# EAGLE design doorbell modernizr v3 + prog v0.2 (EAGLE 7.6.0)
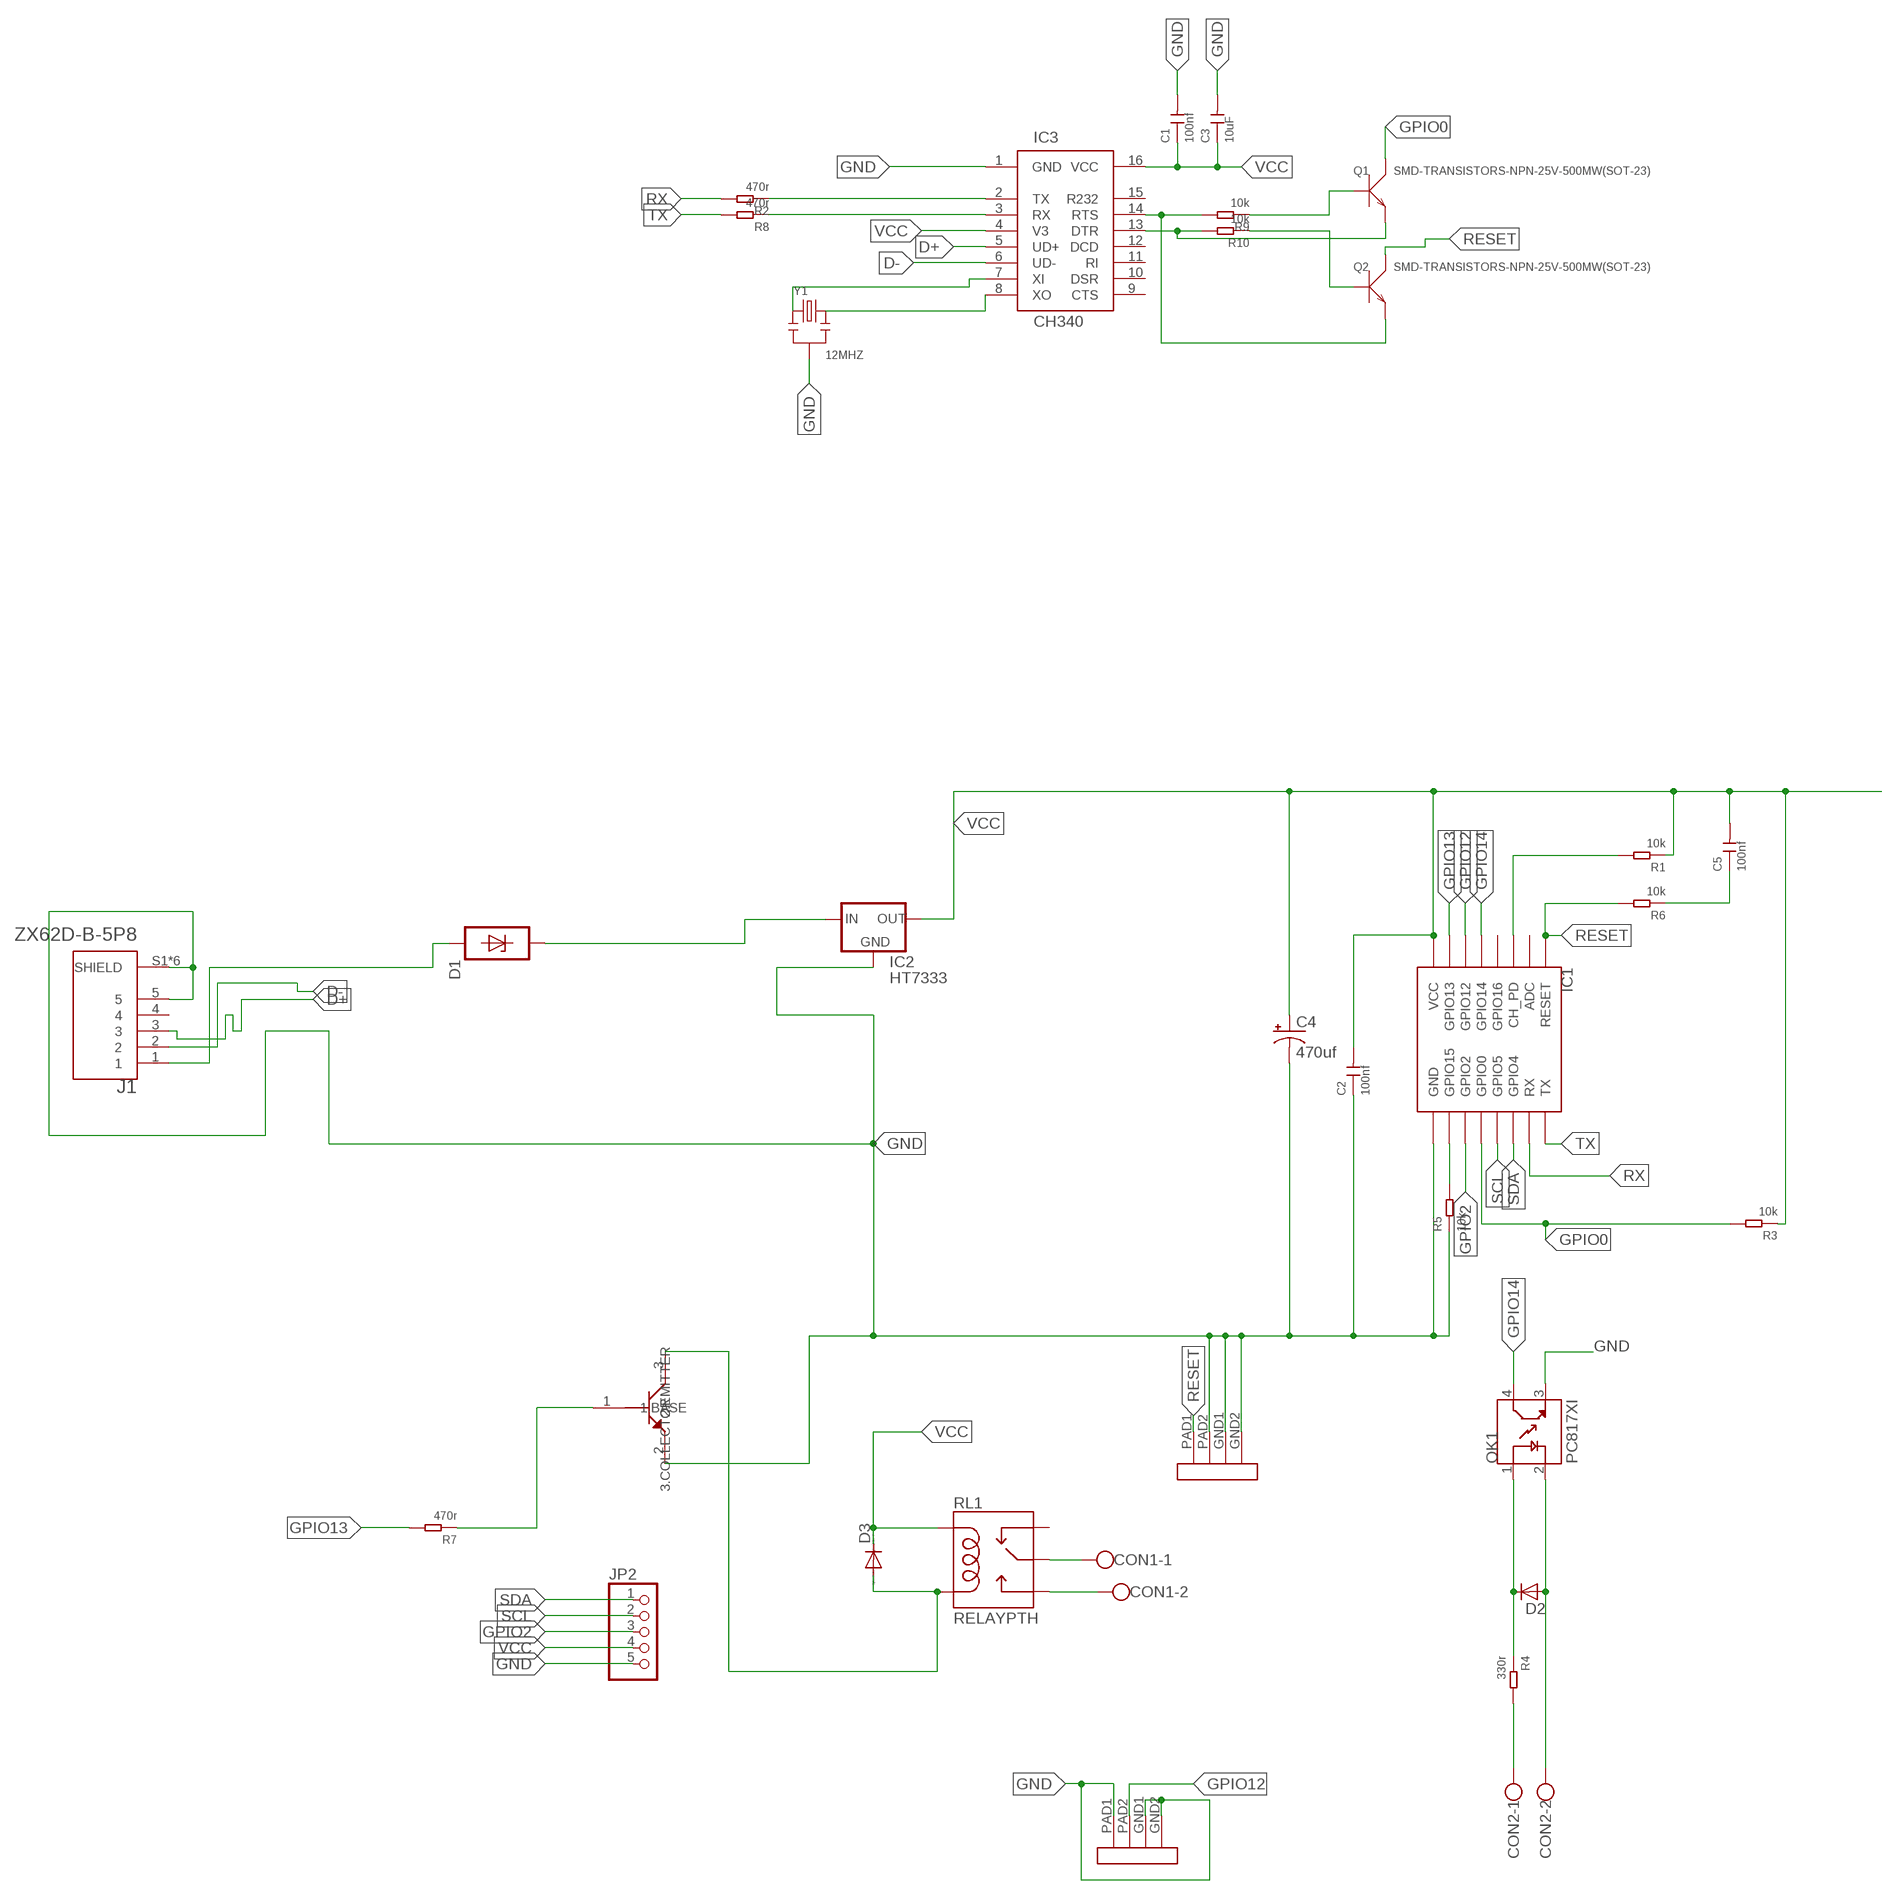
[diagram p0: schematic, sheet 1]

## Parts
C1  100nf  CERAMIC-1UF-25V-10%-X7R(0603)  [C0603]
C2  100nf  CERAMIC-1UF-25V-10%-X7R(0603)  [C0603]
C3  10uF  CERAMIC-1UF-25V-10%-X7R(0603)  [C0603]
C4  470uf  47UF-50V-20%(ELECT)  [PANASONIC_D]
C5  100nf  CERAMIC-1UF-25V-10%-X7R(0603)  [C0603]
CON1  W237-102  [W237-102]
CON2  W237-102  [W237-102]
D1  SP4020-01FTG  [SOD323]
D2  D-SOD123  [SOD123]
D3  DIODE-SOD123  [SOD123]
IC1  ESP12SMD  [ESP12-SMD]
IC2  HT7333  [SOT-89]
IC3  CH340  [SOIC16]
J1  ZX62D-B-5P8  [HRS_ZX62D-B-5P8]
JP2  PINHD-1X5  [1X05]
OK1  PC817XI  [SOIC254P975X460-4N]
Q1  SMD-TRANSISTORS-NPN-25V-500MW(SOT-23)  [SOT-23]
Q2  SMD-TRANSISTORS-NPN-25V-500MW(SOT-23)  [SOT-23]
Q3  2N2222  [SOT23]
R1  10k  SMD-RES-39R-5%-1/10W(0603)  [R0603]
R2  470r  SMD-RES-39R-5%-1/10W(0603)  [R0603]
R3  10k  SMD-RES-39R-5%-1/10W(0603)  [R0603]
R4  330r  SMD-RES-39R-5%-1/10W(0603)  [R0603]
R5  10k  SMD-RES-39R-5%-1/10W(0603)  [R0603]
R6  10k  SMD-RES-39R-5%-1/10W(0603)  [R0603]
R7  470r  SMD-RES-39R-5%-1/10W(0603)  [R0603]
R8  470r  SMD-RES-39R-5%-1/10W(0603)  [R0603]
R9  10k  SMD-RES-39R-5%-1/10W(0603)  [R0603]
R10  10k  SMD-RES-39R-5%-1/10W(0603)  [R0603]
RL1  RELAYPTH  [SRD-05VDC-SL-C]
SW1  MINI-SIDE-SWITCH  [MINI-SIDE-SWITCH]
SW2  MINI-SIDE-SWITCH  [MINI-SIDE-SWITCH]
Y1  12MHZ  SMD-RESONATOR-8MHZ-33PF-0.1%(3P-3.2X1.3MM)  [X3-SMD-3.6X1.3X0.8MM]

## Nets
D+: IC3.5(UD+) J1.3
D-: IC3.6(UD-) J1.2
GND: C1.2 C2.1 C3.2 C4.- IC1.GND IC2.2(GND) IC3.1(GND) J1.5 J1.S1(SHIELD) J1.S2(SHIELD) J1.S3(SHIELD) J1.S4(SHIELD) J1.S5(SHIELD) J1.S6(SHIELD) JP2.5 OK1.3(ET) Q3.2(2.EMITTER) R5.1 SW1.GND1 SW1.GND2 SW1.PAD2 SW2.GND1 SW2.GND2 SW2.PAD1 Y1.2
GPIO0: IC1.GPIO0 Q1.3(C) R3.2
GPIO2: IC1.GPIO2 JP2.3
GPIO12: IC1.GPIO12 SW2.PAD2
GPIO13: IC1.GPIO13 R7.2
GPIO14: IC1.GPIO14 OK1.4(CT)
N$1: IC1.GPIO15 R5.2
N$2: D3.A Q3.3(3.COLLECTOR) RL1.COIL0
N$3: D2.1(C) OK1.1(A) R4.1
N$4: CON2.2 D2.2(A) OK1.2(C)
N$5: IC1.CH_PD R1.2
N$6: CON2.1 R4.2
N$8: CON1.2 RL1.SWOPEN
N$9: IC3.2(TX) R2.1
N$10: D1.1 IC2.4(IN) IC2.P$2(IN)
N$12: CON1.1 RL1.SWCOMMON
N$13: IC3.3(RX) R8.1
N$14: Q3.1(1.BASE) R7.1
N$15: IC3.14(RTS) Q2.2(E) R9.2
N$16: IC3.13(DTR) Q1.2(E) R10.2
N$17: Q1.1(B) R9.1
N$18: Q2.1(B) R10.1
N$19: IC3.8(XO) Y1.3
N$20: IC3.7(XI) Y1.1
N$21: D1.2 J1.1
N$22: C5.1 R6.1
RESET: IC1.RESET Q2.3(C) R6.2 SW1.PAD1
RX: IC1.RXD0(RX) R2.2
SCL: IC1.GPIO5 JP2.2
SDA: IC1.GPIO4 JP2.1
TX: IC1.TXD0(TX) R8.2
VCC: C1.1 C2.2 C3.1 C4.+ C5.2 D3.C IC1.VCC IC2.1(OUT) IC3.4(V3) IC3.16(VCC) JP2.4 R1.1 R3.1 RL1.COIL1
Unconnected: IC1.ADC IC1.GPIO16 IC3.9(CTS) IC3.10(DSR) IC3.11(RI) IC3.12(DCD) IC3.15(R232) J1.4 RL1.SWCLOSED(SWCLOSE)

## Library data of the parts
C1-C3 C5 = Seeed-Capacitor:CERAMIC-1UF-25V-10%-X7R(0603): 302010139; MPN: CC0603KRX7R8BB105; VALUE: 1uf
C4 = SparkFun-Capacitors:47UF-50V-20%(ELECT): CAP-10547; PROD_ID: CAP-10547
CON1 CON2 = con-wago-500:W237-102: WAGO SCREW CLAMP; MPN: 237-102; OC_FARNELL: unknown; OC_NEWARK: 70K9898
D1 = sp4020_10:SP4020-01FTG: SP4020 Series 2.5pF, 30A Discrete TVS Diode Source: http://www.littelfuse.com/~/media/electronics/datasheets/tvs_diode_arrays/littelfuse_tvs_diode_array_sp4020_datasheet.pdf.pdf; MF: Littelfuse; MPN: SP4020-01FTG; OC_FARNELL: unknown; OC_NEWARK: 05X0400
D2 = semicon-smd-ipc:D-: DIODE unfilled
D3 = diode:DIODE-: DIODE
IC1 = esp8266modules:ESP12: ESP8266 Wifi module 12
IC2 = Lemcke solutions:HT73*
IC3 = CH340:CH340; AVAILABILITY: Unavailable; DESCRIPTION: CH340G USB 2.0 to UART _RS232/RS422/RS485_ Bridge Interface Evaluation Board; MF: DFRobot; MP: CH340; PACKAGE: None; PRICE: None
J1 = ZX62D-B-5P8:ZX62D-B-5P8: SMD+DIP Micro USB; MICRO-B-SMD; AVAILABILITY: Unavailable; DESCRIPTION: USB - micro B USB 2.0 Receptacle Connector 5 Position Surface Mount, Right Angle; Through Hole; MF: Hirose; MP: ZX62D-B-5P8; PACKAGE: None; PRICE: None
JP2 = pinhead:PINHD-1X5: PIN HEADER
OK1 = PC817XI:PC817XI: Semiconductors and Actives, Optocouplers/Optoisolators, trans, Optoelectronics, smd; AVAILABILITY: Unavailable; DESCRIPTION: Optoisolator Transistor Output 5000Vrms 1 Channel 4-SMD; MF: Sharp Microelectronics; MP: PC817XI; PACKAGE: SMD-4 Sharp; PRICE: None
Q1 Q2 = SMD-TRANSISTORS-NPN-25V-500MW_SOT-23_:SMD-TRANSISTORS-NPN-25V-500MW(SOT-23): 305010017; AVAILABILITY: Unavailable; DESCRIPTION: Isolated Module DC DC Converter 1 Output 5V 200mA 4.5V - 5.5V Input; MF: Recom Power; MP: S8050; PACKAGE: SOT-23 Micro Commercial; PRICE: None
Q3 = Lemcke solutions:2N2222: 1.2V Voltage Reference 50ppm/°C, SOT23, 3-Terminal Source: Data sheet <http://datasheets.maxim-ic.com/en/ds/MAX6520.pdf>; MF: MAXIM; MPN: MAX6520EUR-T; OC_FARNELL: unknown; OC_NEWARK: 02J4586
R1-R10 = Seeed-Resistor:SMD-RES-39R-5%-1/10W(0603): 301010138; MPN: RC0603JR-0739RL; VALUE: 39R 1/10W
RL1 = SRD-05VDC-SL-C:RELAY: SPDT relay (COM-00101)
SW1 SW2 = Lemcke solutions:MINI-SIDE-SWITCH
Y1 = Seeed-Crystal Oscillator:SMD-RESONATOR-8MHZ-33PF-0.1%(3P-3.2X1.3MM): 306030005; MPN: CSTCE8M00G15L99-R0; VALUE: 8MHZ

## Net classes
0 default: width 0.203 mm, clearance 0.205 mm

## Board
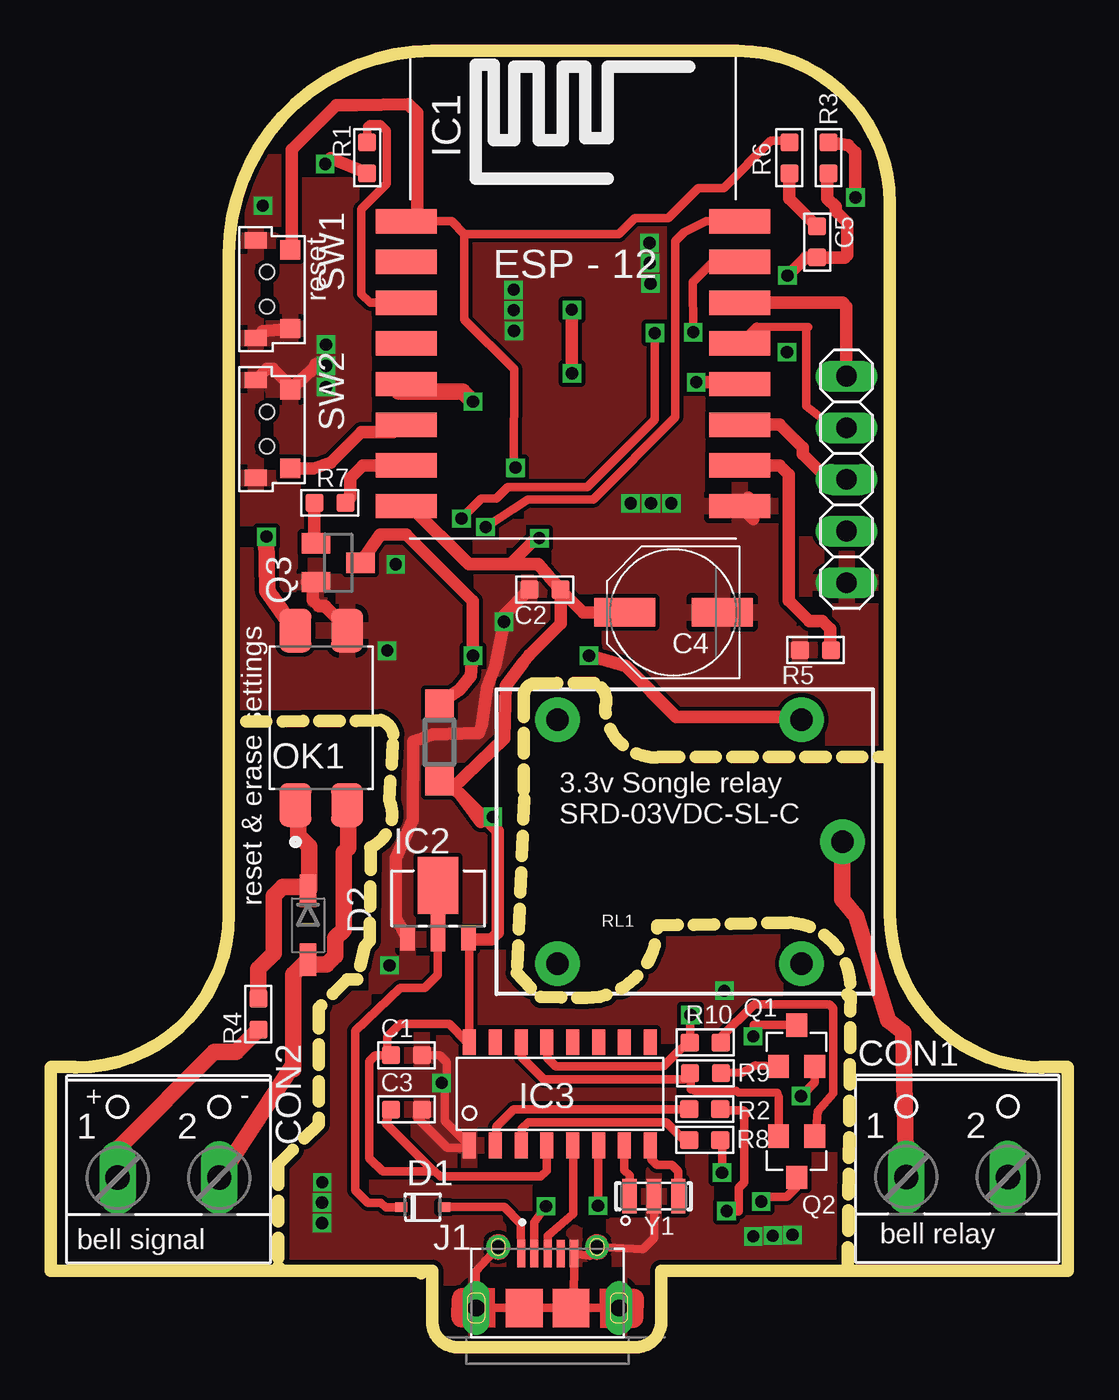
[diagram p1: board, top side]
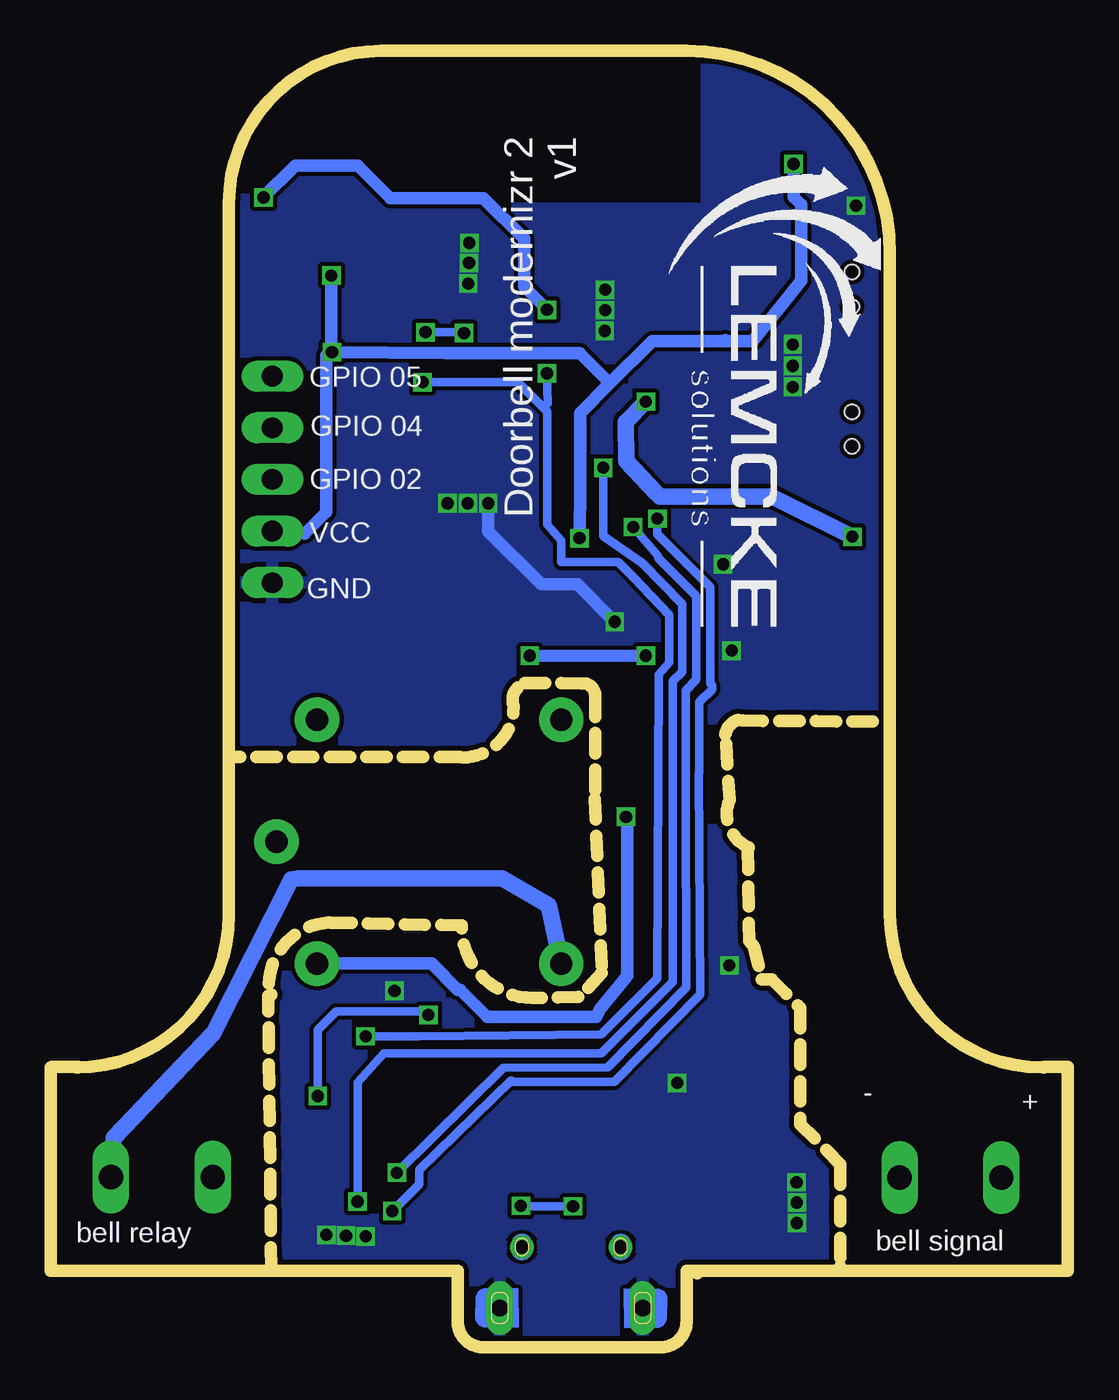
[diagram p2: board, bottom side, seen from below]

Size 50 x 63.75 mm. Coordinates in mm from the lower left corner, seen from the top.
Outline: 29.75,29 arc-90 27.25,31.5 arc90 26.7,32.67 23.8,32.65 arc90 23.25,32 23.25,27
Outline: 23.27,26.95 22.91,18.4 23.81,17.42
Outline: 16.22,30.85 arc-90 16.81,29.65 16.64,26.92 arc-90 15.67,24.57
Outline: 24.08,17.23 26.32,17.17 arc90 29.81,20.74 36.34,20.88 arc-90 39.29,17.55
Outline: 18.14,3.71 arc-90 18.21,3.64
Outline: 50,13.75 50,3.75 30,3.75 30,1.25 arc-90 28.75,0 20,0 arc-90 18.75,1.25 18.75,3.75 0,3.75 0,13.75
Outline: 29.89,29.01 41.11,29.01
Outline: 39.17,3.92 39.31,17.27 arc-90 39.16,17.36
Outline: 16,30.81 9.11,30.76
Outline: 15.73,24.46 15.67,19.98 15.44,19.72 15.06,18.08 14.57,18.08 13.17,16.68 13.17,10.97 11.19,8.99 11.19,3.95 11.24,3.89
Outline: 48.75,13.75 arc-90 41.25,21.25 41.25,56.25 arc90 33.75,63.75 18.75,63.75 arc90 8.75,53.75 8.75,21.25 arc-90 1.25,13.75
Outline: 49.97,13.78 48.67,13.78 arc90 48.65,13.76
Outline: 0.01,13.79 1.15,13.79 arc-90 1.18,13.75
Copper layers (1*16): Top 0.035mm / dielectric 1.5mm / Bottom 0.035mm
Design rules "SeeedStudio_2layer_DRU_no_angle_20140221": minimum track width 6mil, minimum drill 12mil, track to track 6mil, track to pad 6mil, pad to pad 6mil, via to via 6mil, smd to smd 0mil, copper to edge 10mil, drill to drill 10mil, minimum pad ring 10mil, minimum via ring 6mil, stop-mask expansion 2mil, vias tented up to drill 100mil, thermal gap 10mil

### Footprints (pad centres in the part's own frame; a part is rotated, then mirrored left to right if it is on the bottom)
C0603 = smd 0.889 x 0.889: 1 0,0.762; 2 0,-0.762
PANASONIC_D = smd 3 x 1.4: + 2.4,0; - -2.4,0
W237-102 = drill 1.194 long: 1 -2.5,-1.27; 2 2.5,-1.27
SOD323 = smd 0.6 x 0.45: 1 -1.06,0; 2 1.06,0
SOD123 = smd 1.6 x 0.8: 1 -1.7,0; 2 1.7,0
SOD123' = smd 1.4 x 1.4: A 1.9,0; C -1.9,0
ESP12-SMD = smd 3 x 1.2: ADC -8.3,3.8; CH_PD -8.3,1.8; GND 8.1,-8.2; GPIO0 8.1,-2.2; GPIO2 8.1,-4.2; GPIO4 8.1,1.8; GPIO5 8.1,-0.2; GPIO12 -8.3,-4.2; GPIO13 -8.3,-6.2; GPIO14 -8.3,-2.2; GPIO15 8.1,-6.2; GPIO16 -8.3,-0.2; RESET -8.3,5.8; RXD0 8.1,3.8; TXD0 8.1,5.8; VCC -8.3,-8.2
SOT-89 = smd 0.7 x 1.1: 1 1.5,-2.385; 2 -1.5,-2.385 | smd 2 x 2.8: 4 0,0.265 | smd 0.711 x 1.822: P$2 -0.01,-2.07
SOIC16 = smd 1.27 x 0.635: 1 -2.54,3.81; 2 -2.54,2.54; 3 -2.54,1.27; 4 -2.54,0; 5 -2.54,-1.27; 6 -2.54,-2.54; 7 -2.54,-3.81; 8 -2.54,-5.08; 9 2.54,-5.08; 10 2.54,-3.81; 11 2.54,-2.54; 12 2.54,-1.27; 13 2.54,0; 14 2.54,1.27; 15 2.54,2.54; 16 2.54,3.81
HRS_ZX62D-B-5P8 = smd 0.4 x 1.35: 1 -1.3,2.6; 2 -0.65,2.6; 3 0,2.6; 4 0.65,2.6; 5 1.3,2.6 | drill 0.65 pad 1.05: S1 -2.425,2.925; S2 2.425,2.925 | drill 0.825 pad 0.95 long: S3 -3.513,-0.075; S6 3.513,-0.075 | smd 1.8 x 1.9: S4 -1.15,-0.075; S5 1.15,-0.075
1X05 = drill 1.016 long: 1 -5.08,0; 2 -2.54,0; 3 0,0; 4 2.54,0; 5 5.08,0
SOIC254P975X460-4N = smd 2.13 x 1.57: 1 -4.29,1.27; 2 -4.29,-1.27; 3 4.29,-1.27; 4 4.29,1.27
SOT-23 = smd 1.016 x 1.143: 1 -0.889,-1.016; 2 0.889,-1.016; 3 0,1.016
SOT23 = smd 1 x 1.4: 1 -0.95,-1.1; 2 0.95,-1.1; 3 0,1.1
R0603 = smd 0.889 x 0.889: 1 0,0.762; 2 0,-0.762
SRD-05VDC-SL-C = drill 1.1 pad 2.184: COIL0 -5.39,-6.12; COIL1 -5.39,5.88; SWCLOSED 6.61,-6.12; SWCOMMON -7.39,-0.12; SWOPEN 6.61,5.88
MINI-SIDE-SWITCH = smd 0.8 x 1.1: GND1 -2.4,-0.55; GND2 2.4,-0.55 | smd 0.954 x 1: PAD1 -1.936,1.15; PAD2 1.936,1.15 | hole 0.7: -0.85,0; 0.85,0
X3-SMD-3.6X1.3X0.8MM = smd 0.7 x 1.7: 1 -1.2,0; 2 0,0; 3 1.2,0

### Placement (x,y rotation side)
C1  17.48,14.36 90 top
C2  24.29,37.26 90 top
C3  17.48,11.69 90 top
C4  30.6,36.14 180 top
C5  37.67,54.35 0 top
CON1  44.55,9.64 0 top
CON2  5.78,9.61 0 top
D1  18.28,6.89 0 top
D2  12.64,20.76 270 top
D3  [SOD123']  19.1,29.74 90 top
IC1  25.78,49.56 0 top
IC2  19.03,22.45 0 top
IC3  24.39,12.46 90 top
J1  24.42,2 0 top
JP2  39.12,42.67 270 top
OK1  13.3,30.95 90 top
Q1  36.66,14.83 0 top
Q2  36.66,9.37 180 top
Q3  14.13,38.58 270 top
R1  15.55,58.49 180 top
R2  32.14,11.71 90 top
R3  38.23,58.49 180 top
R4  10.2,16.38 0 top
R5  37.59,34.28 90 top
R6  36.3,58.49 180 top
R7  13.71,41.52 90 top
R8  32.14,10.19 90 top
R9  32.18,13.47 270 top
R10  32.17,14.99 270 top
RL1  31.52,24.74 180 top
SW1  10.62,52.03 270 top
SW2  10.62,45.15 270 top
Y1  29.65,7.43 0 top

### Tracks (layer width: path | path; a pad name or v marks a point on that pad's centre or on a via)
D+
  Top 0.406: J1.3 24.42,5.47 25.67,6.57 25.67,9.9 IC3.5
D-  (via drill 0.6)
  Top 0.406: J1.2 23.77,6.15 v24.34,6.93 | v26.9,6.96 26.9,9.89 IC3.6
  Bottom 0.406: v24.34,6.93 26.86,6.92 v26.9,6.96
GND  (via drill 0.6)
  Top 0.406: 18.24,14.18 C1.2 19.11,14.36 19.46,14 19.46,13.18 19.23,12.94 | 19.37,13.05 19.37,11.13 IC3.1 20.46,9.8 19.5,9.8 18,11.3 C3.2 | J1.S5 25.7,1.96 J1.5 26.5,4.49 J1.S2 29.09,4.81 29.66,5.38 Y1.2 | J1.S5 J1.S6 | J1.S5 J1.S4 J1.S3 20.89,3.72 J1.S1
  Top 0.61: 34.29,41.77 IC1.GND 34.52,40.71 | 13.08,48.2 12.95,48.2 13.01,48.25 13.01,48.34 13.07,48.28 SW2.PAD1 11.77,47.27 10.92,48.12 10.64,48.12 SW2.GND1 | IC2.2 16.96,21.12 16.95,24.04 17.8,25.93 17.81,29.79 18.77,30.14 21.03,30.19 21.19,30.58 21.44,32.5 21.84,33.5 v22.28,35.67 22.28,36.01 C2.1 | SW1.PAD2 10.42,49.98 SW1.GND2 | OK1.3 14.56,35.33 13.48,36.41 13.48,36.44 13.18,36.44 12.87,36.75 12.87,37.47 Q3.2 12.59,37.63
  Bottom 0.61: v28.5,41.5 28.5,40.12 25.9,37.52 24.13,37.52 v22.28,35.67
  other vias: 22.75,51 29.5,41.5 30.5,41.5 29.48,52.31 29.45,53.33 29.43,54.3 22.77,49.98 22.75,52 13.53,48.26 19.21,12.99 13.34,8.11 36.46,5.52 16.65,18.78 16.95,38.5 10.42,56.13 33.11,17.53 13.33,7.11 13.33,6.1 35.49,5.48 34.53,5.45 13.53,49.31 13.53,47.22 16.53,34.25
  pour Top: -25.51,77.58 17.25,66.5 17.25,56.5 17.75,56 33.75,56 34.25,56.5 34.25,62 35.25,63 83.07,76.24 59.33,-0.11 -38.26,-7.33
  pour Bottom: -23.25,76.5 17.75,76.5 17.75,55.5 18.25,55.5 18.25,56 33.75,56 33.75,63 36.25,63 36.25,77.5 37.25,77.5 82.25,76.5 81.91,-4.36 -23.59,-4.36
GPIO0  (via drill 0.6)
  Top 0.406: Q1.3 34.56,15.84 v34.52,15.29
  Top 0.61: 33.82,47.42 IC1.GPIO0 | IC1.GPIO0 34.87,47.36 | 33.9,47.39 IC1.GPIO0 | R3.2 39.19,59.12 39.55,58.76 v39.55,56.54 | v25.61,51.02 25.61,47.98 v25.61,47.89 | v31.73,47.45 33.78,47.45 IC1.GPIO0
  Bottom 0.406: 25.79,46.2 25.59,46 25.59,40.46 24.92,39.66 24.92,38.6 22.12,38.6 21.38,37.86 19.59,36.01 19.61,33.67 20.12,33.07 20.18,18.15 22.96,15.39 31.92,15.29 v34.51,15.29 v34.52,15.29 | 25.79,46.2 27.05,47.46 28.94,47.46 v31.73,47.45 | v25.61,47.89 25.58,46.41 25.79,46.2
  Bottom 0.61: v39.55,56.54 37.98,58.11 34.92,58.11 33.31,56.51 28.74,56.51 26.74,54.51 26.74,52.15 v25.61,51.02
GPIO2
  Top 0.61: JP2.3 38.33,42.55 36.97,43.91 36.97,44.24 35.84,45.37 IC1.GPIO2
GPIO12
  Top 0.61: IC1.GPIO12 16.84,45 15.25,45 13.75,43.5 12.89,43.2 SW2.PAD2
GPIO13
  Top 0.61: IC1.GPIO13 15.34,43.36 14.73,42.75 14.73,41.77 R7.2
GPIO14  (via drill 0.6)
  Top 0.813: v20.75,46.5 20.25,47 17.11,47 IC1.GPIO14 | OK1.4 10.65,37.17 v10.6,39.86
  Bottom 0.813: v20.75,46.5 21.75,45.5 21.72,43.57 20.25,42 20.07,41.82 14.55,41.82 v10.6,39.86
N$1
  Top 0.61: IC1.GPIO15 35.83,43.36 36.28,42.91 36.28,36.71 37.27,35.72 37.91,35.72 38.31,35.32 38.31,34.32 R5.2
N$2  (via drill 0.6)
  Top 0.61: v26.46,34.01 28.25,33.5 30.75,31 37.25,31 RL1.COIL0 | D3.A 20.09,32.33 20.65,33 20.72,33.97 v20.75,34 20.75,36.69 17.47,39.97 16.19,39.97 Q3.3
  Bottom 0.61: v26.46,34.01 v20.75,34
N$3
  Top 0.813: R4.1 10.2,18.61 10.95,19.36 10.95,22.19 11.39,22.63 12.69,22.63 | 12.69,22.63 12.69,24.63 12.16,25.16 12.16,26.52 OK1.1 | 12.69,22.63 12.69,22.51 D2.1
N$4
  Top 0.813: CON2.2 11.77,13.65 11.91,13.65 11.91,18.33 D2.2 12.87,18.82 13.56,18.82 13.98,19.25 13.98,20.12 14.39,20.53 14.39,24.32 14.62,24.55 14.62,26.6 OK1.2
N$5
  Top 0.406: IC1.CH_PD 15.69,51.36 15.27,51.79 15.27,55.97 16.51,57.22 16.51,59.83 16.19,60.15 15.66,60.15 15.56,60.05 15.56,59.26 R1.2
N$6
  Top 0.813: CON2.1 3.38,9.87 8.04,14.53 9.11,14.53 R4.2
N$8
  Bottom 0.61: 27.82,23.06 27.81,23.07
  Bottom 0.813: RL1.SWOPEN 25.53,21.72 27.81,23.07 37.87,23.07 38.17,23.01 42.02,15.43 46.9,10.3 CON1.2
N$9
  Top 0.406: R2.1 22.75,11.71 21.88,10.84 21.88,9.96 IC3.2
N$10
  Top 0.406: 19.14,21.85 19.03,21.96 | 14.97,7.73 14.97,15.57 17.18,17.66 18.37,17.66 19.03,18.32 IC2.P$2 | 15.49,7.21 14.97,7.73 | 14.97,7.73 14.97,7.71 15.57,7.11 16.22,7.11 16.46,6.87 17.2,6.87 D1.1
  Top 0.61: IC2.4 19.03,21.96 IC2.P$2
N$12
  Top 0.813: CON1.1 41.9,15.48 41.17,16.06 39.59,21.19 38.91,22.03 RL1.SWCOMMON
N$13
  Top 0.406: R8.1 31.11,10.19 30.24,11.07 23.46,11.07 23.15,10.76 23.15,9.95 IC3.3
N$14
  Top 0.61: R7.1 12.95,39.6 Q3.1
N$15
  Top 0.406: IC3.14 23.15,14.97 23.15,14.26 24.23,13.18 31.12,13.18 R9.2 31.47,13.1 31.47,12.67 31.66,12.62 33.68,12.62 33.79,12.53 35.72,12.52 35.78,12.31 35.78,11.63 35.78,10.94 Q2.2
N$16  (via drill 0.6)
  Top 0.406: IC3.13 24.41,14.97 24.41,14.23 24.82,13.82 30.11,13.82 30.97,14.68 R10.2 31.44,14.74 v31.44,16.34 | Q1.2 37.55,13.02 v36.88,12.35
  Bottom 0.406: v36.88,12.35 36.88,15.59 35.97,16.5 31.61,16.5 v31.44,16.34
N$17
  Top 0.406: Q1.1 34.62,13.85 33.97,13.49 32.99,13.52 R9.1
N$18
  Top 0.406: R10.1 32.91,15.2 34.57,16.86 38.27,16.86 38.47,16.66 38.47,12.48 37.69,11.59 37.61,10.44 Q2.1
N$19
  Top 0.406: Y1.3 30.85,8.65 30.52,8.97 29.78,8.97 29.52,9.23 29.52,9.86 IC3.8
N$20
  Top 0.406: Y1.1 28.45,8.45 28.19,8.71 28.19,9.91 IC3.7
N$21
  Top 0.406: J1.1 23.1,6.08 22.28,6.89 D1.2
N$22
  Top 0.61: R6.1 36.3,56.47 C5.1
RESET  (via drill 0.6)
  Top 0.406: v22.84,43.25 22.76,43.3 22.78,48.09 20.33,50.54 20.33,54.74 | 20.33,54.74 19.71,55.36 18.06,55.36 IC1.RESET | 20.33,54.74 27.92,54.74 28.7,55.52 30.36,55.52 31.83,57 33.07,57 35.39,59.33 36.23,59.33 R6.2 | Q2.3 36.66,7.88 36.17,7.39 35.18,7.39 v34.92,7.17
  Top 0.61: 18.06,55.36 18,55.42 18,60.7 17.58,61.12 15.01,61.08 14.04,61.08 11.85,58.88 11.85,54.15 SW1.PAD1
  Bottom 0.406: v34.92,7.17 34.91,13.02 33.64,14.45 22.94,14.45 19.42,17.97 19.42,32.76 18.97,33.21 18.97,36.53 20.92,38.55 22.84,39.89 v22.84,43.25
RX  (via drill 0.6)
  Top 0.406: R2.2 33.02,11.65 33.96,11.65 | 33.96,11.65 34.04,11.65 34.2,11.48 | v33.22,6.7 33.82,6.7 33.82,7.84 34.08,8.1 34.08,11.54 33.96,11.65 | v20.18,40.75 21.16,41.72 21.88,41.72 22.47,42.31 26.37,42.31 29.69,45.62 v29.69,49.88 | v31.58,49.91 31.55,52.38 32.48,53.31 33.83,53.31 IC1.RXD0
  Bottom 0.406: v33.22,6.7 31.9,8.02 31.9,8.73 27.37,13.12 27.39,13.02 27.39,13.06 22.32,13.06 18.08,17.36 18.15,28.23 18.13,28.25 18.13,31.72 17.5,32.35 17.5,32.55 17.59,32.65 17.59,37.39 20.18,39.98 v20.18,40.75 | v29.69,49.88 29.73,49.91 v31.58,49.91
SCL
  Top 0.406: JP2.2 38.48,45.21 37.14,46.27 37.14,50.17 37.22,50.16 34.71,50.2 IC1.GPIO5
SDA
  Top 0.61: JP2.1 39.11,47.73 39.11,51.18 38.93,51.36 IC1.GPIO4
TX  (via drill 0.6)
  Top 0.406: R8.2 32.99,10.17 v32.99,8.58 | v21.37,40.33 23.45,41.69 26.66,41.69 30.7,45.74 30.69,45.76 30.69,54.39 31.14,54.84 32.21,55.36 IC1.TXD0
  Top 0.61: IC1.TXD0 34.06,55.36
  Bottom 0.406: v32.99,8.58 27.75,13.75 22.63,13.76 18.76,17.69 18.79,27.49 18.79,27.64 18.79,32.3 18.27,32.83 18.27,36.94 20.13,38.8 20.14,38.83 20.17,38.94 v21.37,40.33
VCC  (via drill 0.6)
  Top 0.406: C3.1 16.47,11.01 18.81,8.68 | 18.81,8.68 18.85,8.68 19.13,8.4 24.09,8.4 24.37,8.68 24.37,9.9 IC3.4 | 18.81,8.68 18.77,8.64 16.31,8.64 15.66,9.28 15.66,14.06 15.96,14.36 C1.1 16.55,14.53 16.55,15.27 17.17,15.89 19.58,15.89 20.48,15 IC3.16 20.58,20.02 IC2.1
  Top 0.61: IC2.1 21.64,20.06 21.97,20.39 21.97,25.38 20.11,27.24 | 20.11,27.24 D3.C 19.72,27.47 22.28,29.94 22.35,32.51 23.21,33.67 23.51,34.03 25.08,35.6 25.08,37.23 C2.2 | IC1.VCC 17.67,41.36 20.53,38.5 22.59,38.5 | 22.59,38.5 23.95,38.51 C2.2 | v24.01,39.79 23.7,39.61 22.59,38.5 | v21.72,26.08 21.14,25.83 20.11,27.24 | C4.+ 26.17,36.14 C2.2 | R1.1 13.76,58.46 v13.49,58.19 | 36.3,48.94 v36.18,48.93 | v36.21,52.7 37.1,53.59 C5.2 39.03,53.59 39.14,53.7 39.14,55.3 38.58,55.86 38.58,56.08 38.17,56.48 38.17,57.67 R3.1
  Bottom 0.61: 16.81,49.48 15.5,49.48 13.11,52.45 13.11,56.17 13.49,56.55 v13.49,58.19 | 16.81,49.48 20.44,49.48 22.52,47.4 | 22.52,47.4 23.98,45.94 23.98,42.5 v24.01,39.79 | RL1.COIL1 31.29,18.87 30,17.58 29.87,17.58 28.54,16.26 27.77,16.26 27.77,16.25 23.2,16.26 23.02,16.62 21.67,18.26 21.67,26.02 v21.72,26.08 | 22.52,47.4 24.01,48.89 30.6,48.89 v36.18,48.93 | 16.85,49.52 16.81,49.48 | JP2.4 37.51,40.01 36.47,41.06 36.47,48.77 v36.18,48.93 | v36.21,52.7 36.21,48.96 v36.18,48.93

### Text on the board
tPlace: reset | reset & erase settings | 3.3v Songle relay / SRD-03VDC-SL-C | + | - | bell signal | bell relay
bPlace: Doorbell modernizr 2 / v1 | GPIO 05 | GPIO 04 | GPIO 02 | VCC | GND | - | + | bell relay | bell signal
231bmp: C:/Users/Erik/Downloads/bell-icons-16608.bmp